# Altium schematic sheet rtc.SchDoc
size B; Address1: MILWAUKEE TOOL; Address2: 13135 W. Lisbon Rd.; Address3: Brookfield, WI 53005; SheetNumber: 1; SheetTotal: 1
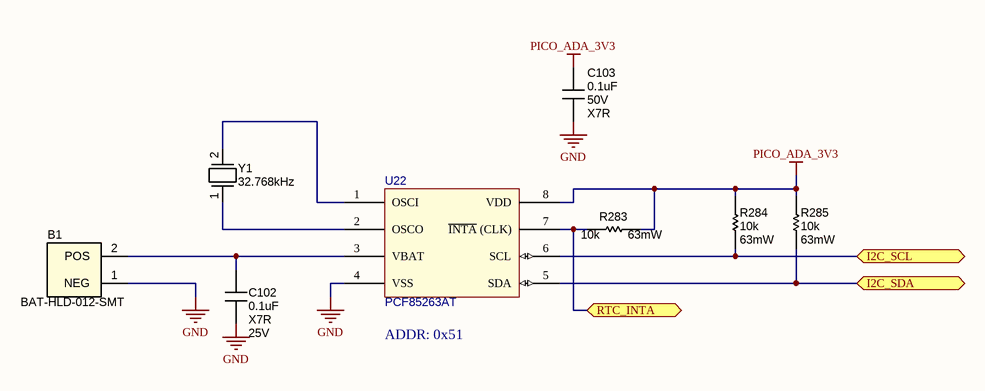
[diagram p0: rtc.SchDoc]

## Parts
B1  BAT-HLD-012-SMT  [BAT-HLD-012-SMT]
C102  0.1uF  Temp Coeff: X7R  Voltage Rating: 25V  [CAPC1608X09N]
C103  0.1uF  Voltage Rating: 50V  Temp Coeff: X7R  [CAPC1005X06N]
R283  10k  Wattage: 63mW  [RESC1005X04N]
R284  10k  Wattage: 63mW  [RESC1005X04N]
R285  10k  Wattage: 63mW  [RESC1005X04N]
U22  PCF85263AT  [SOIC127P600X175-8N]
Y1  32.768kHz  [XTAL_ECS_ECX-12Q]

## Ports
I2C_SCL (bidir), I2C_SDA (bidir), RTC_INTA (bidir)

## Nets
GND: B1.1(NEG) C102.2 C103.2 U22.4(VSS)
PICO_ADA_3V3: C103.1 R283.1 R284.2 R285.2 U22.8(VDD)
I2C_SCL: R284.1 U22.6(SCL) ; port I2C_SCL
I2C_SDA: R285.1 U22.5(SDA) ; port I2C_SDA
RTC_INTA: R283.2 U22.7(~{INTA}_(CLK)) ; port RTC_INTA
NetB1_2: B1.2(POS) C102.1 U22.3(VBAT)
NetU22_1: U22.1(OSCI) Y1.2
NetU22_2: U22.2(OSCO) Y1.1

## Notes on the sheet
- (near U22) ADDR: 0x51
- Schematic Notes
- Schematic Revision History
- Title
- ALL CAPACITORS ARE CERAMIC, 0603, 50V, 10%, X7R UNLESS OTHERWISE STATED
- ALL RESISTORS ARE FILM, 0603, 1/10W, 5%, 200ppm/°C UNLESS OTHERWISE STATED
- Size:
- Date:
- B
- Number:
- Sheet
- Revision:
- of
- Drawn By:
- Brookfield, WI 53005
- File:
- Platform Base:
- Engineer:
- This Document is the property of MILWAUKEE TOOL and may not be reproduced, in any form, without the written premission of MILWAUKEE TOOL.

## Library data of the parts
B1 = CMP-002-0005: BATTERY HOLDER COIN 12MM PC PIN; MFR: TE Connectivity Linx; MFR#: BAT-HLD-012-SMT; Design Item ID: BT/HLDR/SINGLE/COIN/12MM/BAT-HLD-012-SMT; Value: BAT-HLD-012-SMT
C102 = CMP-004-0024: CAP CER 0.1UF 25V X7R 0603; MFR#: CC0603JRX7R8BB104; MFR: Yageo; MFR2#: 0603B104J250CT; Temp Range: -55 / +125 C; Tolerance: 10%; Capacitor Type: Ceramic; Case Code (Imperial): 0608; Design Item ID: CN/0.1uF/25V/X7R/5%/0603; REACH SVHC: Yes; Value: 0.1uF; Height: 0.8mm; MFR2: Walsin; RoHS Compliant: Yes; Case Code (Metric): 1608
C103 = CMP-004-0076: CAP CER SMD 0.1UF 50V X7R 0402; MFR3#: KGM05CR71H104KH; MFR#: GRM155R71H104KE14D; MFR: Murata Electronics; MFR4#: CL05B104KB54PNC; MFR2#: C1005X7R1H104K050BB; Tolerance: 10%; Populate: Yes; Temp Range: -55 / +125 C; Capacitor Type: Ceramic; Case Code (Imperial): 0402; Value: 0.1uF; MFR4: Samsung Electro-Mechanics; Design Item ID: CN/0.1uF/50V/X7R/10%/0402; Case Code (Metric): 1005; ComponentLink1URL: https://search.murata.co.jp/Ceramy/image/img/A01X/G101/ENG/GRM155R71H104KE14-01.pdf; MFR3: KYOCERA AVX; MFR2: TDK Corporation; ComponentLink1Description: Datasheet; RoHS Compliant: Yes; Part Status: Production
R283-R285 = CMP-025-0026: RES SMD 10K OHM 0.5% 1/16W 0402; MFR2#: RNCF0402DTE10K0; MFR#: ERA-2AED103X; MFR: Panasonic Electronic Components; Temp Range: -55 / +155 C; Voltage Rating: 50V; Temperature Coefficient: 25ppm/°C; Quality: AEC-Q200; MFR2: Stackpole Electronics Inc; RoHS Compliant: Yes; ComponentLink1Description: Datasheet; REACH SVHC: Yes; Value: 10k; Case Code (Imperial): 0402; Case Code (Metric): 1005; Tolerance: 0.5%; Resistor Type: Thick Film; Design Item ID: R/10.0K/0.063W/0.5%/0402; ComponentLink1URL: https://industrial.panasonic.com/cdbs/www-data/pdf/RDM0000/AOA0000C307.pdf
U22 = CMP-017-0120: IC OPAMP VFB 1 CIRCUIT 8HVSSOP; MFR: NXP; MFR#: PCF85263AT/AJ; Populate: Yes; REACFH SVCH: Unaffected; Temp Range, Ambient: -40 / +85 C; Voltage Range, Input: 4.5V - 36V DC; Temp Range, Junction: -40 / +150C; Voltage Rating, Output: 0.6V - 36V DC; Value: PCF85263AT/AJ; Design Item ID: IC/RTC/PCF85263AT/SOIC8; Part Status: Production; RoHS Comliant: Yes; Type: RTC; ComponentLink1Description: Datasheet; ComponentLink1URL: https://www.nxp.com/docs/en/data-sheet/PCF85263A.pdf
Y1 = CMP-008-0001: Crystal 0.032768MHz ±20ppm (Tol) 12.5pF FUND 90000Ohm Automotive 2-Pin Ultra Mini-CSMD T/R; MFR2#: FC-12M32.7680KA-A3; MFR: ECS Inc.; MFR#: ECS-.327-12.5-12QS-TR; Quality: AEC-Q200; Temp Range: -40 / +125 C; ESR (Equivalent Series Resistance): 90kR; MFR2: Epson; Capacitance, Load: 12.5pF; Frequency Tolerance: 20ppm; Design Item ID: XTAL/32.768kHz/ECS-.327-12.5-12QS-TR; RoHS Compliant: Yes; Value: 32.768kHz; Frequency: 32.768kHz; Load Capacitance: 12.5pF